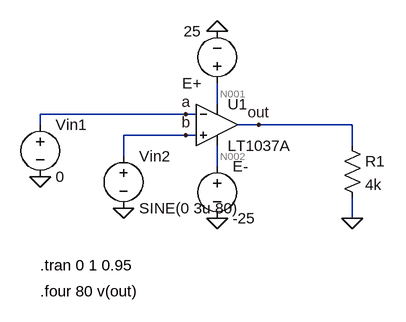
[diagram p0: schematic 2.1.asc]
2.1.asc, the LTspice schematic file:
Version 4
SHEET 1 880 680
WIRE 272 -64 272 -96
WIRE 224 -48 0 -48
WIRE 240 -48 224 -48
WIRE 0 -32 0 -48
WIRE 336 -32 304 -32
WIRE 480 -32 336 -32
WIRE 224 -16 128 -16
WIRE 240 -16 224 -16
WIRE 480 0 480 -32
WIRE 128 16 128 -16
WIRE 272 32 272 0
WIRE 480 112 480 80
FLAG 272 112 0
FLAG 272 -176 0
FLAG 128 96 0
FLAG 0 48 0
FLAG 480 112 0
FLAG 224 -48 a
FLAG 224 -16 b
FLAG 336 -32 out
SYMBOL Opamps\\LT1037A 272 -96 R0
SYMATTR InstName U1
SYMBOL voltage 128 0 R0
WINDOW 123 0 0 Left 2
WINDOW 39 0 0 Left 2
SYMATTR InstName Vin2
SYMATTR Value SINE(0 3u 80)
SYMBOL voltage 0 -48 R0
WINDOW 123 0 0 Left 2
WINDOW 39 0 0 Left 2
SYMATTR InstName Vin1
SYMATTR Value 0
SYMBOL voltage 272 -80 R180
WINDOW 123 0 0 Left 2
WINDOW 39 0 0 Left 2
SYMATTR InstName E+
SYMATTR Value 25
SYMBOL voltage 272 16 R0
WINDOW 123 0 0 Left 2
WINDOW 39 0 0 Left 2
SYMATTR InstName E-
SYMATTR Value -25
SYMBOL res 464 -16 R0
SYMATTR InstName R1
SYMATTR Value 4k
TEXT 0 184 Left 2 !.tran 0 1 0.95
TEXT 0 224 Left 2 !.four 80 v(out)

The netlist it stands for:
* 2.1.asc
XU1 b a N001 N002 out LT1037A  ; pins In+ In- V+ V- OUT
Vin2 b 0 SINE(0 3u 80)
Vin1 a 0 0
V§E+ N001 0 25
V§E- N002 0 -25
R1 out 0 4k
.tran 0 1 0.95
.four 80 v(out)
.backanno
.end

* Results of the author's LTspice run, read from the files saved beside the schematic
* Operating Point, zero values left out:
*   V(n001) = 25 V
*   V(n002) = -25 V
*   I(E-) = 2.666 mA
*   I(E+) = -2.666 mA
*   Ix(u1:3) = 2.666 mA
*   Ix(u1:4) = -2.666 mA
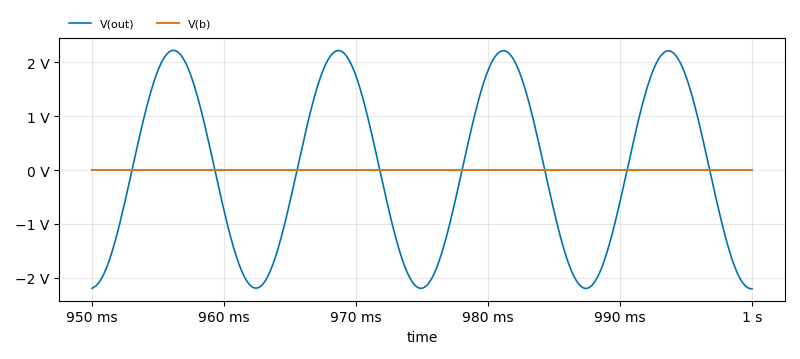
[diagram p1: Transient Analysis of 2.1.asc, plotted from the saved traces]
* Transient Analysis, 1 run:
*   V(out): min -2.204 V, max 2.221 V, average 11.02 mV, rms 1.561 V, last -2.204 V
*   V(b): min -2.992 µV, max 2.992 µV, average 117.9 pV, rms 2.116 µV, last 0 V
* From the log:
*   N-Period=1
*   Fourier components of V(out)
*   DC component:0.00703801
*   Harmonic  Frequency   Fourier   Normalized   Phase    Normalized
*    Number     [Hz]     Component   Component  [degree]  Phase [deg]
*       1     8.000e+01  2.205e+00  1.000e+00    -87.58°      0.00°
*       2     1.600e+02  3.366e-04  1.526e-04    -21.71°     65.86°
*       3     2.400e+02  2.518e-04  1.142e-04    -30.29°     57.29°
*       4     3.200e+02  2.151e-04  9.753e-05    -36.39°     51.19°
*       5     4.000e+02  1.956e-04  8.869e-05    -40.21°     47.37°
*       6     4.800e+02  1.828e-04  8.290e-05    -42.58°     45.00°
*       7     5.600e+02  1.742e-04  7.897e-05    -44.23°     43.35°
*       8     6.400e+02  1.687e-04  7.648e-05    -45.06°     42.52°
*       9     7.200e+02  1.642e-04  7.446e-05    -45.03°     42.55°
*   Total Harmonic Distortion: 0.027965%(0.059707%)